# Altium project Motor-57.PrjPCB
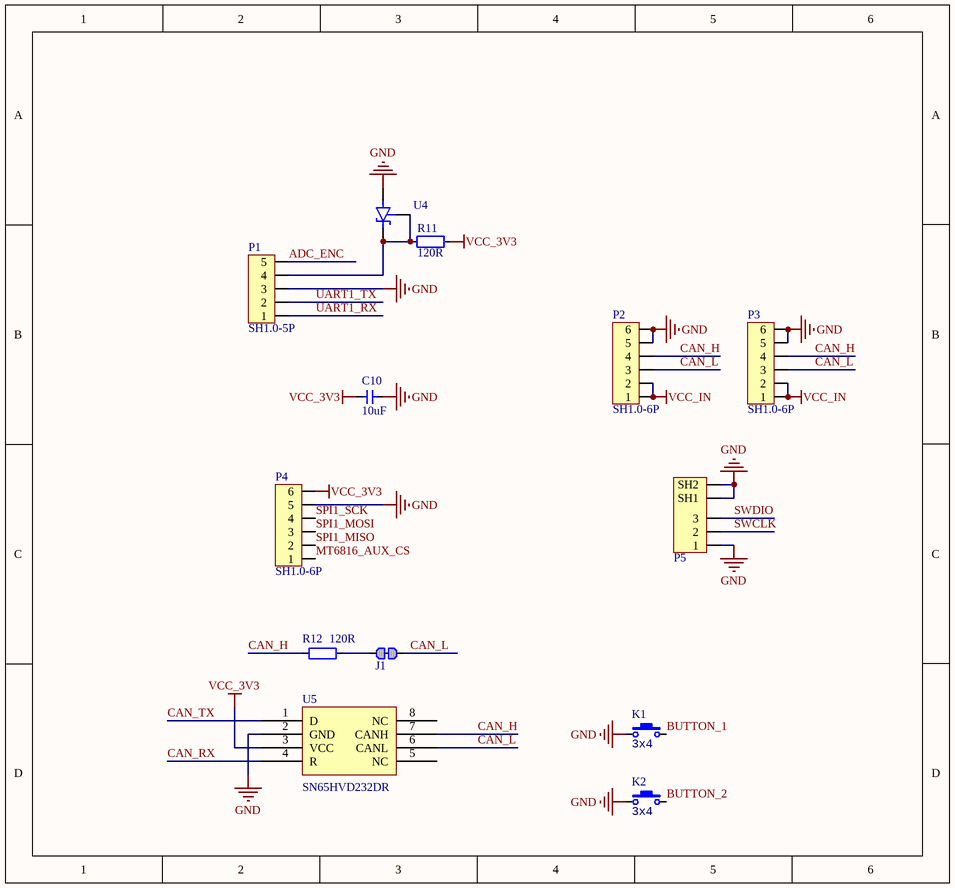
[diagram p0: Port.SchDoc]
2 sheets, 38 parts. Net scope: global (net labels, ports and power ports of the same name join across sheets).
Board file: Motor-57.PcbDoc
Sheets:
  Port.SchDoc
  Power.SchDoc

## Sheet Port.SchDoc
size 177 x 165 mm; SheetNumber: 1; SheetTotal: 1

### Parts
C10  10uF  [CAP_0402]
J1  跳线  [0402-0R]  (value not drawn)
K1  value 3x4  [ButtonTACT_3x4x2_180]  (hidden comment: TACT 2P)
K2  value 3x4  [ButtonTACT_3x4x2_180]  (hidden comment: TACT 2P)
P1  SH1.0-5P  [SH1.0-5P]
P2  SH1.0-6P  [SH1.0-6P]
P3  SH1.0-6P  [SH1.0-6P]
P4  SH1.0-6P  [SH1.0-6P]
P5  SH1.0-3P  [SH1.0-3P]  (value not drawn)
R11  120R  [RES_0402]
R12  120R  [RES_0402]
U4  TL431IDBZT  [SOT23-3]  (value not drawn)
U5  Manufacturer Part Number: SN65HVD232DR  [SO-8]  (hidden comment: SN65HVD232D)

### Nets
GND: C10.1 K1.1 K2.1 P1.3 P2.5 P2.6 P3.5 P3.6 P4.5 P5.1 P5.SH1 P5.SH2 U4.3(ANODE) U5.2(GND)
VCC_3V3: C10.2 P4.6 R11.1 U5.3(VCC)
VCC_IN: P2.1 P2.2 P3.1 P3.2
ADC_ENC: P1.5
BUTTON_1: K1.2
BUTTON_2: K2.2
CAN_H: P2.4 P3.4 R12.1 U5.7(CANH)
CAN_L: J1.2 P2.3 P3.3 U5.6(CANL)
CAN_RX: U5.4(R)
CAN_TX: U5.1(D)
MT6816_AUX_CS: P4.1
SPI1_MISO: P4.2
SPI1_MOSI: P4.3
SPI1_SCK: P4.4
SWCLK: P5.2
SWDIO: P5.3
UART1_RX: P1.1
UART1_TX: P1.2
NetJ1_1: J1.1 R12.2
NetP1_4: P1.4 R11.2 U4.1(CATHODE) U4.2(REF)

Not connected (* = marked no-connect by the designer): U5 5(NC) 8(NC)

### Library data of the parts
C10 = 电容-0402: Capacitor; Value: 0.1u
J1 = 跳线: Resistor; Published: 8-Jun-2000; LatestRevisionDate: 17-Jul-2002; LatestRevisionNote: Re-released for DXP Platform.; PackageReference: AXIAL-0.4; Publisher: Altium Limited; PackageDescription: Axial Device, Thru-Hole; 2 Leads; 0.4 in Pin Spacing
K1 K2 = ButtonTACT_3x4x2_180: Button; type: TACT 2P
P5 = SH1.0-3P: Header
R11 R12 = 电阻-0402: Resistor; Value: 22R
U4 = TL431IDBZT: Adjustable precision shunt regulator 3-SOT-23 -40 to 85; MF: Texas Instruments; Price: None; Package: SOT-23-3 Texas Instruments; Check_prices: https://www.snapeda.com/parts/TL431IDBZT/Texas%20Instruments/view-part/1206577/?ref=eda; Availability: Warning; MP: TL431IDBZT; Value: *; SnapEDA_Link: https://www.snapeda.com/parts/TL431IDBZT/Texas%20Instruments/view-part/1206577/?ref=snap; Purchase-URL: https://pricing.snapeda.com/search/part/TL431IDBZT/?ref=eda
U5 = SN65HVD232D: Manufacturer: Texas Instruments; Protocol: CAN; Number of Drivers/Receivers: 1/1; Duplex: Half; Data Rate: 1Mbps; Voltage - Supply: 3 V ~ 3.6 V; Supplier 1: Digi-Key; Supplier Part Number 1: 296-26344-2-ND; RoHS: RoHS Compliant; Category: Integrated Circuits (ICs); Stock: 5000; Pricing 1: 2500=0.84375 (USD); Packaging: Tape & Reel (TR); Part Status: Active; Type: Transceiver; Operating Temperature: -40°C ~ 85°C; Mounting Type: Surface Mount; Package / Case: 8-SOIC (0.154", 3.90mm Width); Supplier Device Package: 8-SOIC; ComponentLink1URL: http://www.ti.com/lit/ds/symlink/sn65hvd230.pdf; ComponentLink1Description: http://www.ti.com/lit/ds/symlink/sn65hvd230.pdf; Supplier 2: Digi-Key; Supplier Part Number 2: 296-26344-1-ND; Pricing 2: 1=2.05, 10=1.842, 100=1.4809, 500=1.21668, 1000=1.00811 (USD)

## Sheet Power.SchDoc
size 127 x 165 mm; SheetNumber: 1; SheetTotal: 1
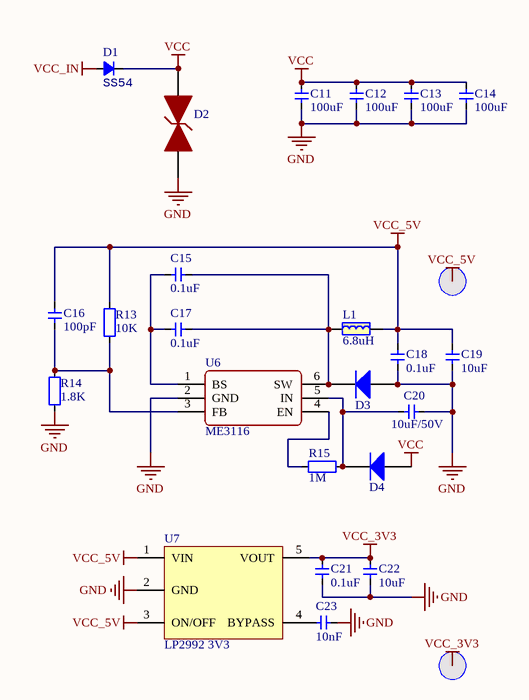
[diagram p1: Power.SchDoc]

### Parts
C11  100uF  [1206-CAP]
C12  100uF  [1206-CAP]
C13  100uF  [1206-CAP]
C14  100uF  [1206-CAP]
C15  0.1uF  [CAP_0402]
C16  100pF  [CAP_0402]
C17  0.1uF  [CAP_0402]
C18  0.1uF  [CAP_0402]
C19  10uF  [CAP_0402]
C20  10uF/50V  [CAP_0402]
C21  0.1uF  [CAP_0402]
C22  10uF  [CAP_0402]
C23  10nF  [CAP_0402]
D1  SS54  [DO-214AC]
D2  SMBJ28CA  [SMBJ-CA_MFG]  (value not drawn)
D3  二极管-5819W  [SOD-323]  (value not drawn)
D4  二极管-5819W  [SOD-323]  (value not drawn)
L1  6.8uH  [IND-201612]
R13  10K  [RES_0402]
R14  1.8K  [RES_0402]
R15  1M  [RES_0402]
T1  测试点  [TEST_PT]  (value not drawn)
T2  测试点  [TEST_PT]  (value not drawn)
U6  ME3116  [SOT23-6]
U7  LP2992 3V3  [SOT23-5]

### Nets
GND: C11.1 C12.1 C13.1 C14.1 C18.1 C19.1 C20.1 C21.1 C22.1 C23.1 D2.1 D3.1(A) R14.1 U6.2(GND) U7.2(GND)
VCC: C11.2 C12.2 C13.2 C14.2 D1.2(K) D2.2 D4.1(A)
VCC_3V3: C21.2 C22.2 T2.0 U7.5(VOUT)
VCC_5V: C16.1 C18.2 C19.2 L1.2 R13.2 T1.0 U7.1(VIN) U7.3(ON/OFF)
VCC_IN: D1.1(A)
NetC15_1: C15.1 C17.1 D3.2(K) L1.1 U6.6(SW)
NetC15_2: C15.2 C17.2 U6.1(BS)
NetC16_2: C16.2 R13.1 R14.2 U6.3(FB)
NetC20_2: C20.2 D4.2(K) R15.1 U6.5(IN)
NetC23_2: C23.2 U7.4(BYPASS)
NetR15_2: R15.2 U6.4(EN)

### Library data of the parts
C11-C14 = 电容-1206: Capacitor; Value: 0.1u
C15-C23 = 电容-0402: Capacitor; Value: 0.1u
D1 = Diode_SMA: Diode; Type: SMA; Value: SS54
D3 D4 = 二极管-5819W: 40V
L1 = 电感-201612
R13-R15 = 电阻-0402: Resistor; Value: 22R
U6 = ME3116: DC-DC
U7 = LP2992: LDO

## Nets that join several sheets
GND: Port (14 pins), Power (15 pins)
VCC_3V3: Port (C10.2 P4.6 R11.1 U5.3), Power (C21.2 C22.2 T2.0 U7.5)
VCC_IN: Port (P2.1 P2.2 P3.1 P3.2), Power (D1.1)